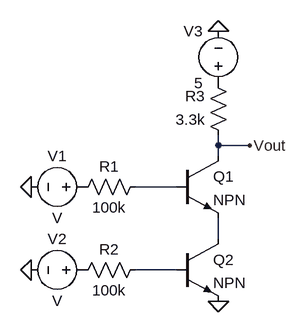
[diagram p0: schematic D4-DÇ5.asc]
D4-DÇ5.asc, the LTspice schematic file:
Version 4
SHEET 1 880 680
WIRE 208 48 208 32
WIRE 256 48 208 48
WIRE 208 64 208 48
WIRE 144 112 80 112
WIRE 208 192 208 160
WIRE 144 240 80 240
FLAG 208 -128 0
FLAG -80 112 0
FLAG -80 240 0
FLAG 208 288 0
FLAG 256 48 Vout
SYMBOL npn 144 64 R0
SYMATTR InstName Q1
SYMBOL npn 144 192 R0
SYMATTR InstName Q2
SYMBOL res 96 96 R90
WINDOW 0 0 56 VBottom 2
WINDOW 3 32 56 VTop 2
SYMATTR InstName R1
SYMATTR Value 100k
SYMBOL res 96 224 R90
WINDOW 0 0 56 VBottom 2
WINDOW 3 32 56 VTop 2
SYMATTR InstName R2
SYMATTR Value 100k
SYMBOL res 224 48 R180
WINDOW 0 36 76 Left 2
WINDOW 3 36 40 Left 2
SYMATTR InstName R3
SYMATTR Value 3.3k
SYMBOL voltage 16 112 R90
WINDOW 0 -32 56 VBottom 2
WINDOW 3 32 56 VTop 2
SYMATTR InstName V1
SYMBOL voltage 16 240 R90
WINDOW 0 -32 56 VBottom 2
WINDOW 3 32 56 VTop 2
SYMATTR InstName V2
SYMBOL voltage 208 -32 R180
WINDOW 0 24 96 Left 2
WINDOW 3 24 16 Left 2
WINDOW 123 0 0 Left 0
WINDOW 39 0 0 Left 0
SYMATTR InstName V3
SYMATTR Value 5

The netlist it stands for:
* D4-DÇ5.asc
Q1 Vout N001 N002 0 NPN
Q2 N002 N003 0 0 NPN
R1 N001 P001 100k
R2 N003 P002 100k
R3 Vout P003 3.3k
V1 P001 0 V
V2 P002 0 V
V3 P003 0 5
.model NPN NPN
.model PNP PNP
.lib standard.bjt
.backanno
.end